# Altium project PCB_Project.PrjPcb
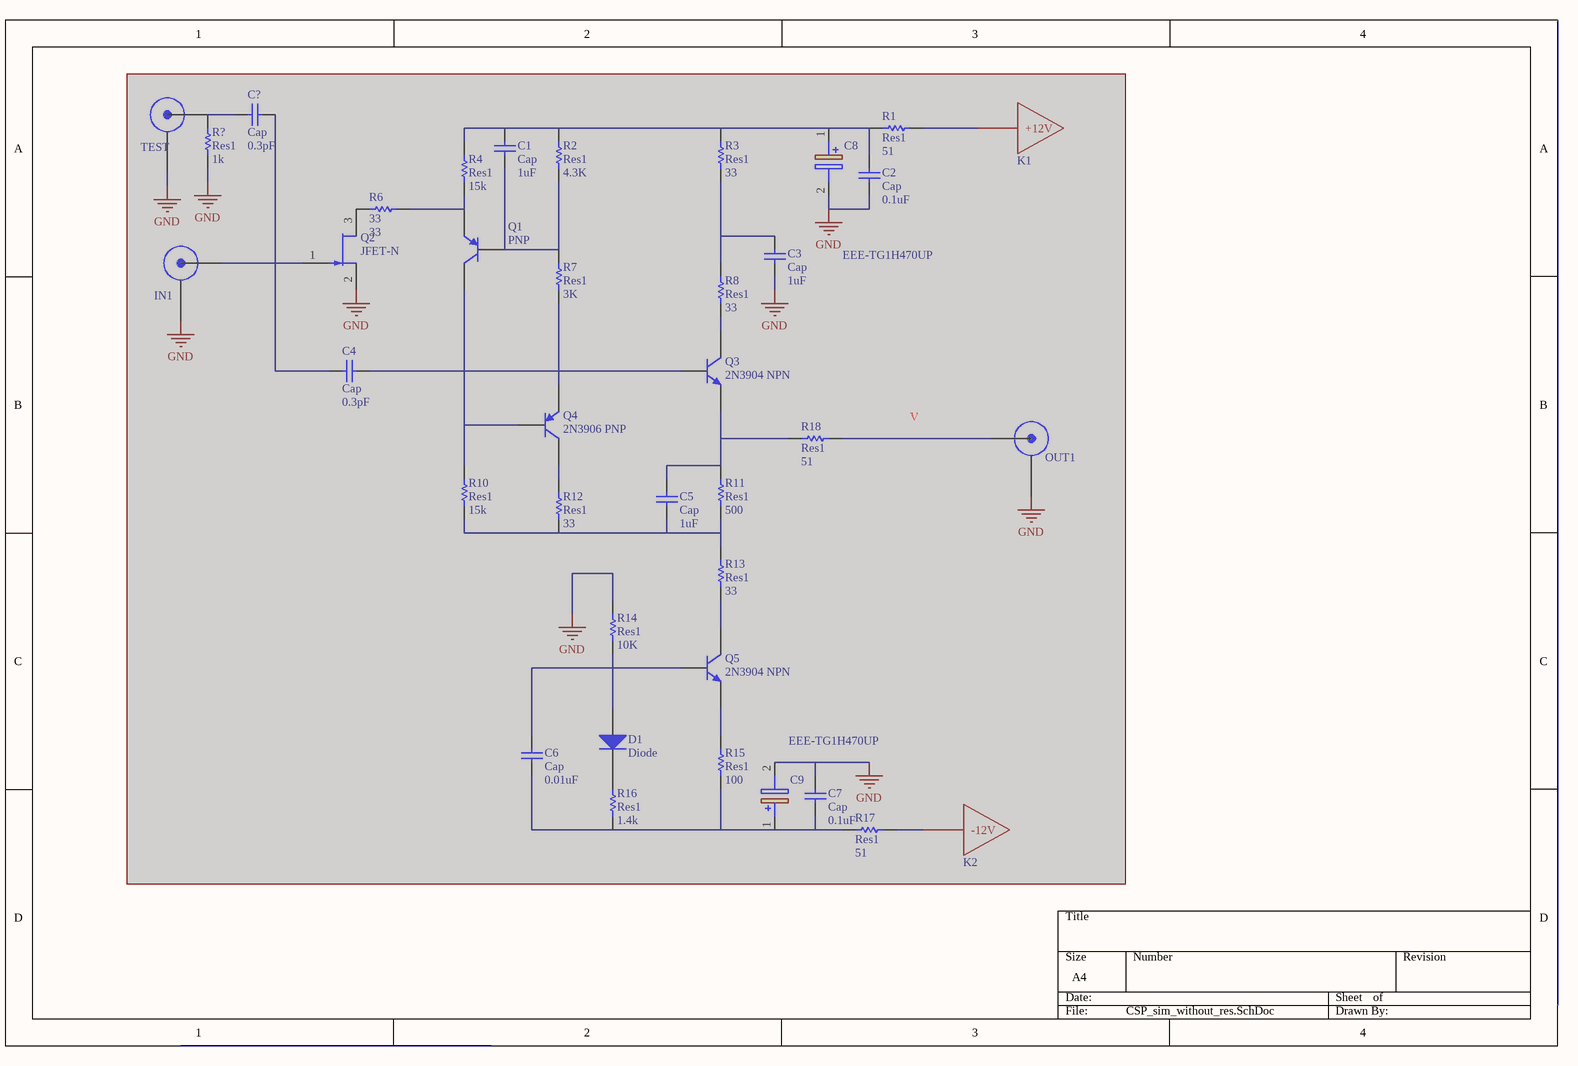
[diagram p0: CSP_sim_without_res.SchDoc]
4 sheets, 139 parts. Net scope: global (net labels, ports and power ports of the same name join across sheets).
Board files: CSP_without_inFET.PcbDoc, CSP_inFET.PcbDoc, Detector_PCB.PcbDoc, Panel.PcbDoc, Panel - Copy.PcbDoc
Sheets:
  CSP_sim_without_res.SchDoc
  CSP_sim_with_res.SchDoc
  CSP_without_inFET.SchDoc
  CSP_inFET.SchDoc

## Sheet CSP_sim_without_res.SchDoc
size A4; DocumentNumber: 1; SheetNumber: 1; SheetTotal: 4

### Parts
(Parts that share a designator on the sheet are numbered #1, #2 ... from top to bottom, then left to right.)
C1#1  Cap  value 1uF  [*CAPC2012X94N]  (masked out: inside a compile mask, not in the netlist)
C2#1  Cap  value 0.1uF  [*CAPC2012X94N]  (masked out: inside a compile mask, not in the netlist)
C3#1  Cap  value 1uF  [*CAPC2012X94N]  (masked out: inside a compile mask, not in the netlist)
C4#1  Cap  value 0.3pF  [0603]  (masked out: inside a compile mask, not in the netlist)
C5#1  Cap  value 1uF  [*CAPC2012X94N]  (masked out: inside a compile mask, not in the netlist)
C6#1  Cap  value 0.01uF  [*CAPC2012X94N]  (masked out: inside a compile mask, not in the netlist)
C7#1  Cap  value 0.1uF  [*CAPC2012X94N]  (masked out: inside a compile mask, not in the netlist)
C8#1  EEE-TG1H470UP  [CAPAE830X1050N]  (masked out: inside a compile mask, not in the netlist)
C9#1  EEE-TG1H470UP  [CAPAE830X1050N]  (masked out: inside a compile mask, not in the netlist)
C?  Cap  value 0.3pF  [0603]  (masked out: inside a compile mask, not in the netlist)
D1#1  Diode  [SODFL350X110-2N]  (masked out: inside a compile mask, not in the netlist)
IN1  INPUT  [IN/OUT]  (value not drawn)  (masked out: inside a compile mask, not in the netlist)
K1#1  +12V  [PAD]  (value not drawn)  (masked out: inside a compile mask, not in the netlist)
K2#1  -12V  [PAD]  (value not drawn)  (masked out: inside a compile mask, not in the netlist)
OUT1#1  OUTPUT  [IN/OUT]  (value not drawn)  (masked out: inside a compile mask, not in the netlist)
Q1#1  PNP  [SOT-23B_N]  (masked out: inside a compile mask, not in the netlist)
Q2#1  JFET-N  [SOT23_M]  (masked out: inside a compile mask, not in the netlist)
Q3#1  2N3904 NPN  [SOT23_M]  (masked out: inside a compile mask, not in the netlist)
Q4#1  2N3906 PNP  [SOT-23B_N]  (masked out: inside a compile mask, not in the netlist)
Q5#1  2N3904 NPN  [SOT23_M]  (masked out: inside a compile mask, not in the netlist)
R1#1  Res1  value 51  [SMD-0805-RES]  (masked out: inside a compile mask, not in the netlist)
R2#1  Res1  value 4.3K  [SMD-0805-RES]  (masked out: inside a compile mask, not in the netlist)
R3#1  Res1  value 33  [SMD-0805-RES]  (masked out: inside a compile mask, not in the netlist)
R4#1  Res1  value 15k  [SMD-0805-RES]  (masked out: inside a compile mask, not in the netlist)
R6#1  33  [SMD-0805-RES]  (masked out: inside a compile mask, not in the netlist)
R7#1  Res1  value 3K  [SMD-0805-RES]  (masked out: inside a compile mask, not in the netlist)
R8#1  Res1  value 33  [SMD-0805-RES]  (masked out: inside a compile mask, not in the netlist)
R10#1  Res1  value 15k  [SMD-0805-RES]  (masked out: inside a compile mask, not in the netlist)
R11#1  Res1  value 500  [SMD-0805-RES]  (masked out: inside a compile mask, not in the netlist)
R12#1  Res1  value 33  [SMD-0805-RES]  (masked out: inside a compile mask, not in the netlist)
R13#1  Res1  value 33  [SMD-0805-RES]  (masked out: inside a compile mask, not in the netlist)
R14#1  Res1  value 10K  [SMD-0805-RES]  (masked out: inside a compile mask, not in the netlist)
R15#1  Res1  value 100  [SMD-0805-RES]  (masked out: inside a compile mask, not in the netlist)
R16#1  Res1  value 1.4k  [SMD-0805-RES]  (masked out: inside a compile mask, not in the netlist)
R17#1  Res1  value 51  [SMD-0805-RES]  (masked out: inside a compile mask, not in the netlist)
R18#1  Res1  value 51  [SMD-0805-RES]  (masked out: inside a compile mask, not in the netlist)
R?  Res1  value 1k  [SMD-0805-RES]  (masked out: inside a compile mask, not in the netlist)
TEST#1  INPUT  [IN/OUT]  (value not drawn)  (masked out: inside a compile mask, not in the netlist)

### Library data of the parts
C1#1 C2#1 C3#1 C4#1 C5#1 C6#1 C7#1 C? = Cap: Capacitor; Published: 8-Jun-2000; LatestRevisionDate: 17-Jul-2002; LatestRevisionNote: Re-released for DXP Platform.; PackageReference: RAD-0.3; Publisher: Altium Limited; PackageDescription: Radial Cap, Thru-Hole; 2 Leads; 0.3 in Pin Spacing
C8#1 C9#1 = EEE-TG1H470UP: Capacitor Polarised; Manufacturer_Name: Panasonic; Datasheet Link: https://industrial.panasonic.com/cdbs/www-data/pdf/RDE0000/ABA0000C1187.pdf; Height: 10.5mm; Manufacturer_Part_Number: EEE-TG1H470UP
Q1#1 Q4#1 = PNP: PNP Bipolar Transistor; Published: 8-Jun-2000; LatestRevisionDate: 29-May-2009; LatestRevisionNote: IPC-7351 Footprint Added.; PackageVersion: Aug-1999; PackageReference: SOT-23B; Publisher: Altium Limited; PackageDescription: 3-Pin SOT-23 Package 0.95 mm Pitch, 2.4 mm Lead Span
Q2#1 = JFET-N: N-Channel JFET; Published: 8-Jun-2000; LatestRevisionDate: 17-Jul-2002; LatestRevisionNote: Re-released for DXP Platform.; PackageReference: TO-254-AA; Publisher: Altium Limited; Code_JEDEC: TO-254-AA
Q3#1 Q5#1 = NPN: NPN Bipolar Transistor; Published: 8-Jun-2000; LatestRevisionDate: 17-Jul-2002; LatestRevisionNote: Re-released for DXP Platform.; PackageReference: TO-226-AA; Publisher: Altium Limited; PackageDescription: TO, Flat Index; 3 In-Line, Axial Leads; Body Dia. 4.8mm; Leads 0.55 x 0.51 mm (max); Code_JEDEC: TO-226-AA
R1#1 R2#1 R3#1 R4#1 R6#1 R7#1 R8#1 R10#1 R11#1 R12#1 R13#1 R14#1 R15#1 R16#1 R17#1 R18#1 R? = Res1: Resistor; Published: 8-Jun-2000; LatestRevisionDate: 17-Jul-2002; LatestRevisionNote: Re-released for DXP Platform.; PackageReference: AXIAL-0.3; Publisher: Altium Limited; PackageDescription: Axial Device, Thru-Hole; 2 Leads; 0.3 in Pin Spacing
  R6#1: Value: 33

## Sheet CSP_sim_with_res.SchDoc
size A4; DocumentNumber: 4; SheetNumber: 4; SheetTotal: 4
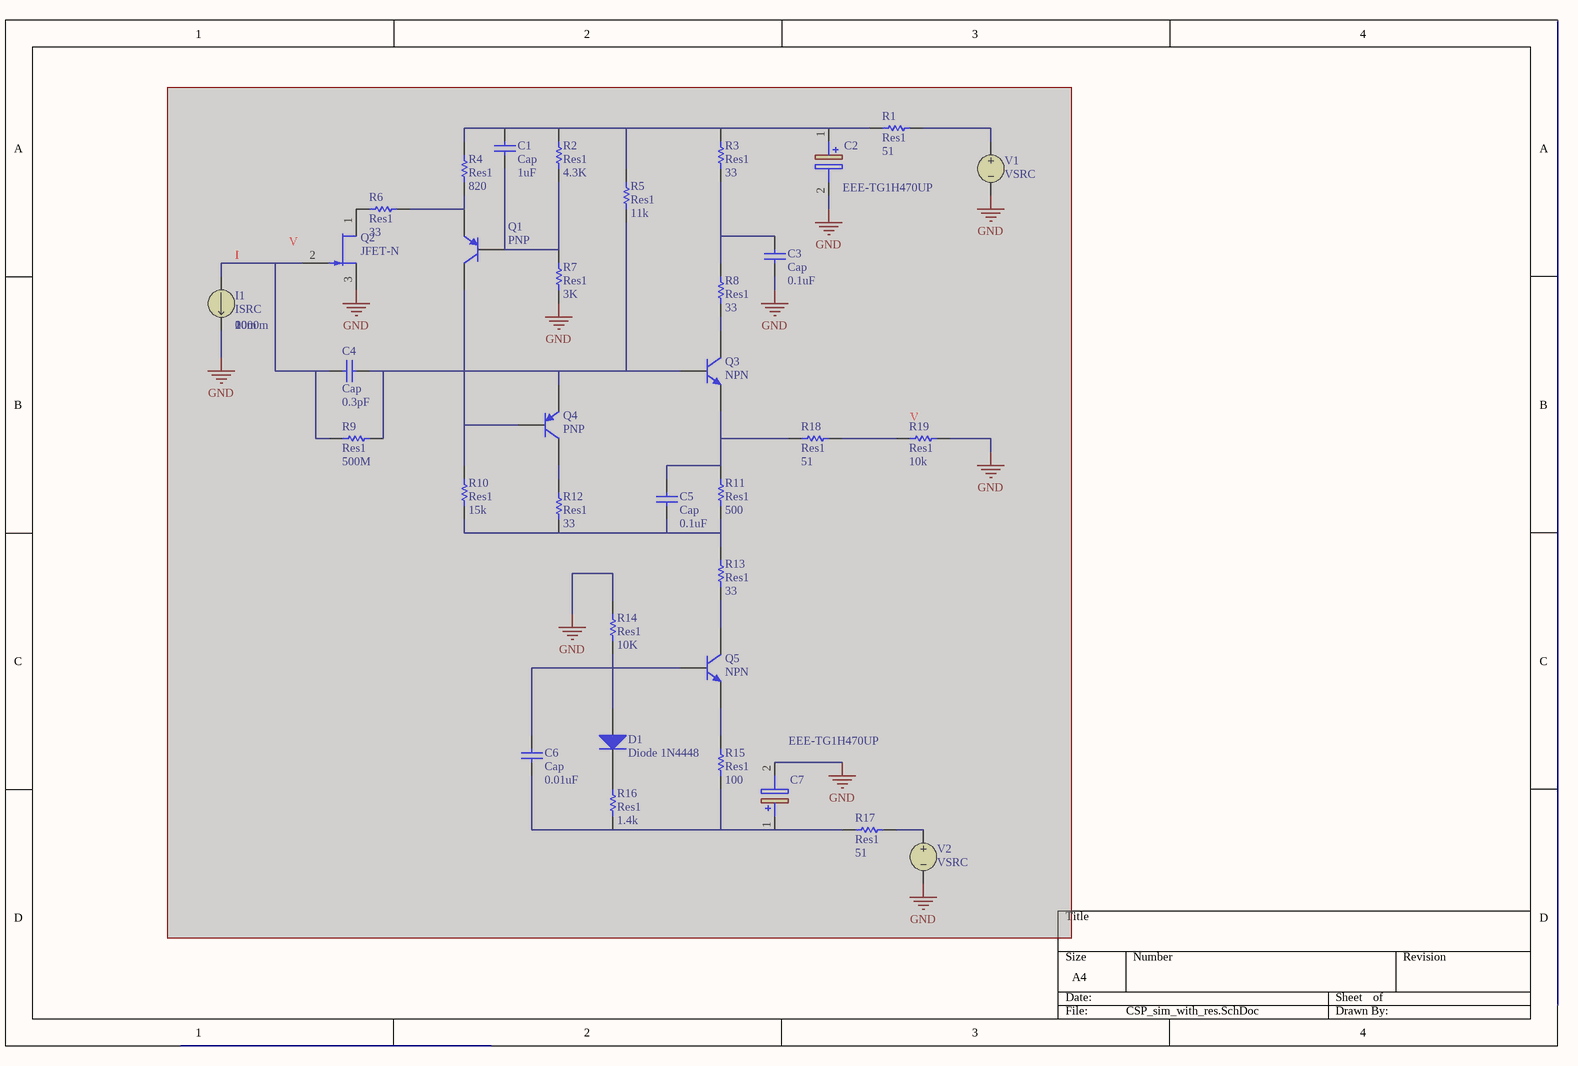
[diagram p1: CSP_sim_with_res.SchDoc]

### Parts
(Parts that share a designator on the sheet are numbered #1, #2 ... from top to bottom, then left to right.)
C1#2  Cap  value 1uF  [*CAPC2012X94N]  (masked out: inside a compile mask, not in the netlist)
C2#2  EEE-TG1H470UP  [CAPAE830X1050N]  (masked out: inside a compile mask, not in the netlist)
C3#2  Cap  value 0.1uF  [*CAPC2012X94N]  (masked out: inside a compile mask, not in the netlist)
C4#2  Cap  value 0.3pF  [0603]  (masked out: inside a compile mask, not in the netlist)
C5#2  Cap  value 0.1uF  [*CAPC2012X94N]  (masked out: inside a compile mask, not in the netlist)
C6#2  Cap  value 0.01uF  [*CAPC2012X94N]  (masked out: inside a compile mask, not in the netlist)
C7#2  EEE-TG1H470UP  [CAPAE830X1050N]  (masked out: inside a compile mask, not in the netlist)
D1#2  Diode 1N4448  [DO-35]  (masked out: inside a compile mask, not in the netlist)
I1  ISRC  Initial Value: 0  Pulsed Value: 1000m  Pulse Width: 10m  Period: 20m  (masked out: inside a compile mask, not in the netlist)
Q1#2  PNP  [SOT-23B_N]  (masked out: inside a compile mask, not in the netlist)
Q2#2  JFET-N  [TO-254-AA]  (masked out: inside a compile mask, not in the netlist)
Q3#2  NPN  [TO-226-AA]  (masked out: inside a compile mask, not in the netlist)
Q4#2  PNP  [SOT-23B_N]  (masked out: inside a compile mask, not in the netlist)
Q5#2  NPN  [TO-226-AA]  (masked out: inside a compile mask, not in the netlist)
R1#2  Res1  value 51  [SMD-0805-RES]  (masked out: inside a compile mask, not in the netlist)
R2#2  Res1  value 4.3K  [SMD-0805-RES]  (masked out: inside a compile mask, not in the netlist)
R3#2  Res1  value 33  [SMD-0805-RES]  (masked out: inside a compile mask, not in the netlist)
R4#2  Res1  value 820  [SMD-0805-RES]  (masked out: inside a compile mask, not in the netlist)
R5#1  Res1  value 11k  [SMD-0805-RES]  (masked out: inside a compile mask, not in the netlist)
R6#2  Res1  value 33  [SMD-0805-RES]  (masked out: inside a compile mask, not in the netlist)
R7#2  Res1  value 3K  [SMD-0805-RES]  (masked out: inside a compile mask, not in the netlist)
R8#2  Res1  value 33  [SMD-0805-RES]  (masked out: inside a compile mask, not in the netlist)
R9#1  Res1  value 500M  [SMD-0805-RES]  (masked out: inside a compile mask, not in the netlist)
R10#2  Res1  value 15k  [SMD-0805-RES]  (masked out: inside a compile mask, not in the netlist)
R11#2  Res1  value 500  [SMD-0805-RES]  (masked out: inside a compile mask, not in the netlist)
R12#2  Res1  value 33  [SMD-0805-RES]  (masked out: inside a compile mask, not in the netlist)
R13#2  Res1  value 33  [SMD-0805-RES]  (masked out: inside a compile mask, not in the netlist)
R14#2  Res1  value 10K  [SMD-0805-RES]  (masked out: inside a compile mask, not in the netlist)
R15#2  Res1  value 100  [SMD-0805-RES]  (masked out: inside a compile mask, not in the netlist)
R16#2  Res1  value 1.4k  [SMD-0805-RES]  (masked out: inside a compile mask, not in the netlist)
R17#2  Res1  value 51  [SMD-0805-RES]  (masked out: inside a compile mask, not in the netlist)
R18#2  Res1  value 51  [SMD-0805-RES]  (masked out: inside a compile mask, not in the netlist)
R19  Res1  value 10k  [SMD-0805-RES]  (masked out: inside a compile mask, not in the netlist)
V1  VSRC  (masked out: inside a compile mask, not in the netlist)
V2  VSRC  (masked out: inside a compile mask, not in the netlist)

### Library data of the parts
C1#2 C3#2 C4#2 C5#2 C6#2 = Cap: Capacitor; Published: 8-Jun-2000; LatestRevisionDate: 17-Jul-2002; LatestRevisionNote: Re-released for DXP Platform.; PackageReference: RAD-0.3; Publisher: Altium Limited; PackageDescription: Radial Cap, Thru-Hole; 2 Leads; 0.3 in Pin Spacing
C2#2 C7#2 = EEE-TG1H470UP: as C8#1 on sheet CSP_sim_without_res; Datasheet Link: https://industrial.panasonic.com/cdbs/www-data/pdf/RDE0000/ABA0000C1187.pdf; Height: 10.5mm; Manufacturer_Part_Number: EEE-TG1H470UP
D1#2 = Diode 1N4448: High Conductance Fast Diode; Published: 8-Jun-2000; LatestRevisionDate: 17-Jul-2002; LatestRevisionNote: Re-released for DXP Platform.; DatasheetVersion: 1997; PackageReference: DO-35; Publisher: Altium Limited; PackageDescription: Diode, Axial; Body 3.8 x 1.9 mm (LxDia. max), Lead Dia. 0.53 mm (max); Code_JEDEC: DO-204-AH; ComponentLink1Description: Manufacturer Link; ComponentLink1URL: http://www.fairchildsemi.com/; ComponentLink2Description: Datasheet; ComponentLink2URL: http://www.fairchildsemi.com/ds/1N%2F1N4448.pdf
I1 = ISRC: Current Source; Note: PCB Footprint - Not required; Published: 8-Jun-2000; LatestRevisionDate: 17-Jul-2002; LatestRevisionNote: Re-released for DXP Platform.; PackageReference: Not Applicable; Publisher: Altium Limited
Q1#2 Q4#2 = PNP: PNP Bipolar Transistor; Published: 8-Jun-2000; LatestRevisionDate: 29-May-2009; LatestRevisionNote: IPC-7351 Footprint Added.; PackageVersion: Aug-1999; PackageReference: SOT-23B; Publisher: Altium Limited; PackageDescription: 3-Pin SOT-23 Package 0.95 mm Pitch, 2.4 mm Lead Span
Q2#2 = JFET-N: N-Channel JFET; Published: 8-Jun-2000; LatestRevisionDate: 17-Jul-2002; LatestRevisionNote: Re-released for DXP Platform.; PackageReference: TO-254-AA; Publisher: Altium Limited; Code_JEDEC: TO-254-AA
Q3#2 Q5#2 = NPN: NPN Bipolar Transistor; Published: 8-Jun-2000; LatestRevisionDate: 17-Jul-2002; LatestRevisionNote: Re-released for DXP Platform.; PackageReference: TO-226-AA; Publisher: Altium Limited; PackageDescription: TO, Flat Index; 3 In-Line, Axial Leads; Body Dia. 4.8mm; Leads 0.55 x 0.51 mm (max); Code_JEDEC: TO-226-AA
R1#2 R2#2 R3#2 R4#2 R5#1 R6#2 R7#2 R8#2 R9#1 R10#2 R11#2 R12#2 R13#2 R14#2 R15#2 R16#2 R17#2 R18#2 R19 = Res1: Resistor; Published: 8-Jun-2000; LatestRevisionDate: 17-Jul-2002; LatestRevisionNote: Re-released for DXP Platform.; PackageReference: AXIAL-0.3; Publisher: Altium Limited; PackageDescription: Axial Device, Thru-Hole; 2 Leads; 0.3 in Pin Spacing
V1 = VSRC: Voltage Source; Note: PCB Footprint - Not required; Value: 12; Published: 8-Jun-2000; LatestRevisionDate: 17-Jul-2002; LatestRevisionNote: Re-released for DXP Platform.; PackageReference: Not Applicable; Publisher: Altium Limited
V2 = VSRC: Voltage Source; Note: PCB Footprint - Not required; Value: -12; Published: 8-Jun-2000; LatestRevisionDate: 17-Jul-2002; LatestRevisionNote: Re-released for DXP Platform.; PackageReference: Not Applicable; Publisher: Altium Limited

## Sheet CSP_without_inFET.SchDoc
size A4; DocumentNumber: 2; SheetNumber: 2; SheetTotal: 4
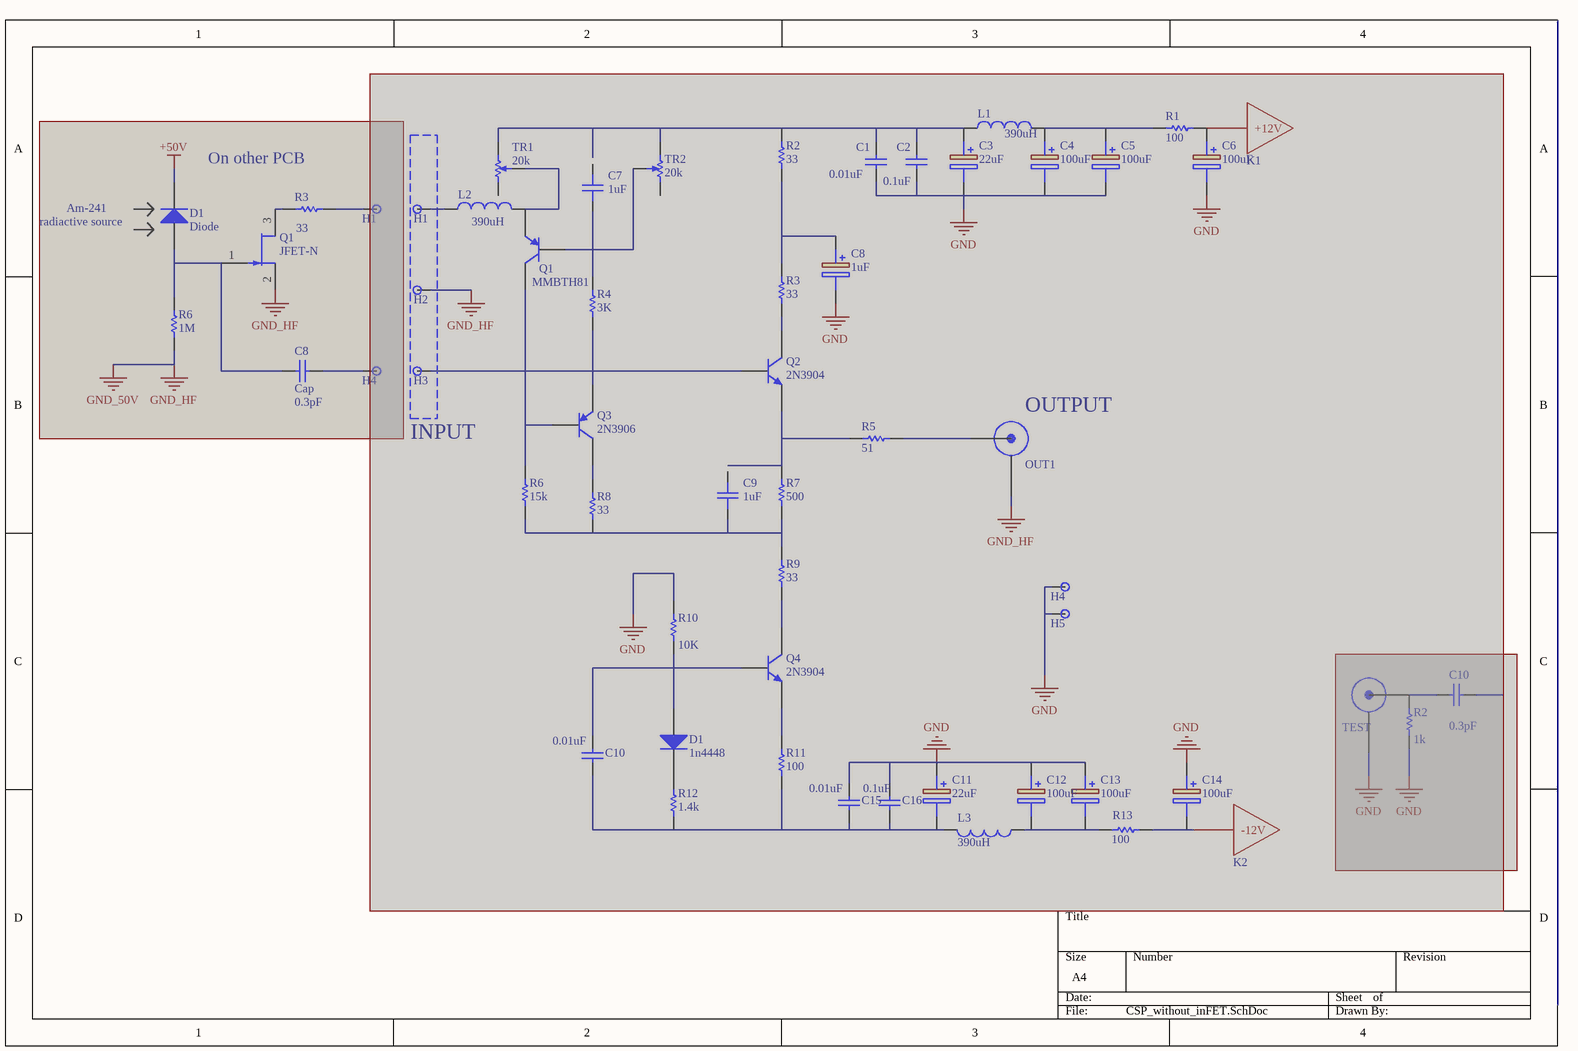
[diagram p2: CSP_without_inFET.SchDoc]

### Parts
(Parts that share a designator on the sheet are numbered #1, #2 ... from top to bottom, then left to right.)
C1#3  0.01uF  [SMD-0805-C]  (masked out: inside a compile mask, not in the netlist)
C2#3  0.1uF  [SMD-0805-C]  (masked out: inside a compile mask, not in the netlist)
C3#3  22uF  [CAPAE660X550N]  (masked out: inside a compile mask, not in the netlist)
C4#3  100uF  [CAPAE660X800N]  (masked out: inside a compile mask, not in the netlist)
C5#3  100uF  [CAPAE660X800N]  (masked out: inside a compile mask, not in the netlist)
C6#3  100uF  [CAPAE660X800N]  (masked out: inside a compile mask, not in the netlist)
C7#3  1uF  [CAPC3225X15L]  (masked out: inside a compile mask, not in the netlist)
C8#2  1uF  [CAPAE430X550N]  (masked out: inside a compile mask, not in the netlist)
C8#3  Cap  value 0.3pF  [0603]  (masked out: inside a compile mask, not in the netlist)
C9#2  1uF  [CAPC3225X15L]  (masked out: inside a compile mask, not in the netlist)
C10#1  value 0.3pF  [0603]  (hidden comment: Cap)  (masked out: inside a compile mask, not in the netlist)
C10#2  0.01uF  [SMD-0805-C]  (masked out: inside a compile mask, not in the netlist)
C11  22uF  [CAPAE660X550N]  (masked out: inside a compile mask, not in the netlist)
C12  100uF  [CAPAE660X800N]  (masked out: inside a compile mask, not in the netlist)
C13  100uF  [CAPAE660X800N]  (masked out: inside a compile mask, not in the netlist)
C14  100uF  [CAPAE660X800N]  (masked out: inside a compile mask, not in the netlist)
C15  0.01uF  [SMD-0805-C]  (masked out: inside a compile mask, not in the netlist)
C16  0.1uF  [SMD-0805-C]  (masked out: inside a compile mask, not in the netlist)
D1#3  Diode  [SMC]  (masked out: inside a compile mask, not in the netlist)
D1#4  1n4448  [SODFL350X110-2N]  (masked out: inside a compile mask, not in the netlist)
H1#1  PAD  [PAD]  (value not drawn)  (no BOM)  (masked out: inside a compile mask, not in the netlist)
H1#2  PAD  [PAD]  (value not drawn)  (no BOM)  (masked out: inside a compile mask, not in the netlist)
H2  PAD  [PAD]  (value not drawn)  (no BOM)  (masked out: inside a compile mask, not in the netlist)
H3  PAD  [PAD]  (value not drawn)  (no BOM)  (masked out: inside a compile mask, not in the netlist)
H4#1  PAD  [PAD]  (value not drawn)  (no BOM)  (masked out: inside a compile mask, not in the netlist)
H4#2  PAD  [PAD]  (value not drawn)  (no BOM)  (masked out: inside a compile mask, not in the netlist)
H5  PAD  [PAD]  (value not drawn)  (no BOM)  (masked out: inside a compile mask, not in the netlist)
K1#2  +12V  [PAD]  (value not drawn)  (no BOM)  (masked out: inside a compile mask, not in the netlist)
K2#2  -12V  [PAD]  (value not drawn)  (no BOM)  (masked out: inside a compile mask, not in the netlist)
L1  390uH  [INDC3225X270N]  (masked out: inside a compile mask, not in the netlist)
L2  390uH  [INDC3225X270N]  (masked out: inside a compile mask, not in the netlist)
L3  390uH  [INDC3225X270N]  (masked out: inside a compile mask, not in the netlist)
OUT1#2  OUTPUT  [IN/OUT]  (value not drawn)  (no BOM)  (masked out: inside a compile mask, not in the netlist)
Q1#3  JFET-N  [SOT23_M]  (masked out: inside a compile mask, not in the netlist)
Q1#4  MMBTH81  [SOT23-3P95_240X110L53X44N]  (masked out: inside a compile mask, not in the netlist)
Q2#3  2N3904  [SOT23-3P95_240X110L53X44N]  (masked out: inside a compile mask, not in the netlist)
Q3#3  2N3906  [SOT23-3P95_240X110L53X44N]  (masked out: inside a compile mask, not in the netlist)
Q4#3  2N3904  [SOT23-3P95_240X110L53X44N]  (masked out: inside a compile mask, not in the netlist)
R1#3  100  [SMD-0805-RES]  (masked out: inside a compile mask, not in the netlist)
R2#3  33  [SMD-0805-RES]  (masked out: inside a compile mask, not in the netlist)
R2#4  value 1k  [SMD-0805-RES]  (hidden comment: Res1)  (masked out: inside a compile mask, not in the netlist)
R3#3  value 33  [SMD-0805-RES]  (masked out: inside a compile mask, not in the netlist)
R3#4  33  [SMD-0805-RES]  (masked out: inside a compile mask, not in the netlist)
R4#3  3K  [SMD-0805-RES]  (masked out: inside a compile mask, not in the netlist)
R5#2  51  [SMD-0805-RES]  (masked out: inside a compile mask, not in the netlist)
R6#3  value 1M  [SMD-0805-RES]  (masked out: inside a compile mask, not in the netlist)
R6#4  15k  [SMD-0805-RES]  (masked out: inside a compile mask, not in the netlist)
R7#3  500  [SMD-0805-RES]  (masked out: inside a compile mask, not in the netlist)
R8#3  33  [SMD-0805-RES]  (masked out: inside a compile mask, not in the netlist)
R9#2  33  [SMD-0805-RES]  (masked out: inside a compile mask, not in the netlist)
R10#3  10K  [SMD-0805-RES]  (masked out: inside a compile mask, not in the netlist)
R11#3  100  [SMD-0805-RES]  (masked out: inside a compile mask, not in the netlist)
R12#3  1.4k  [SMD-0805-RES]  (masked out: inside a compile mask, not in the netlist)
R13#3  100  [SMD-0805-RES]  (masked out: inside a compile mask, not in the netlist)
TEST#2  INPUT  [IN/OUT]  (value not drawn)  (masked out: inside a compile mask, not in the netlist)
TR1  20k  [POT4MM-2]  (masked out: inside a compile mask, not in the netlist)
TR2  20k  [POT4MM-2]  (masked out: inside a compile mask, not in the netlist)

### Blocks framed on the sheet
On other PCB: C8#3 D1#3 H1#1 H4#1 Q1#3 R3#3 R6#3

### Notes on the sheet
- (near D1#3) radiactive source
- Am-241
- INPUT
- (near OUT1#2) OUTPUT

### Library data of the parts
C1#3 C2#3 C8#3 C10#1 C10#2 C15 C16 = Cap: Capacitor; Published: 8-Jun-2000; LatestRevisionDate: 17-Jul-2002; LatestRevisionNote: Re-released for DXP Platform.; PackageReference: RAD-0.3; Publisher: Altium Limited; PackageDescription: Radial Cap, Thru-Hole; 2 Leads; 0.3 in Pin Spacing
  C1#3 C10#2 C15: Value: 0.01uF; LCSC Part #: C1710
  C2#3 C16: Value: 0.1uF; LCSC Part #: C49678
C3#3 C11 = TYEH1V226F55MTR: 22uF 35V, Capacitor Polarised; Part number: TYEH1V226F55MTR; Value: 22uF; Dimension: 6.3x5.3mm; Voltage: 35V; LCSC Part #: C249771
C4#3 C5#3 C6#3 C12-C14 = EEEFK1E101P: 100uF 25V, cap polarised; Part number: EEEFK1E101P; Dimensions: 8x6.2mm; Voltage: 25V; Value: 100uF; LCSC Part #: C249983
C7#3 C9#2 = capacitor: Value: 1uF
C8#2 = UWT1H010MCL1GB: 1uF 50V, Capacitor Polarised; Manufacturer_Name: Nichicon; Part number: UWT1H010MCL1GB; Dimensions: 4x5.4mm; Value: 1uF; Voltage: 50V; LCSC Part #: *
D1#3 = Diode: Default Diode; Published: 8-Jun-2000; LatestRevisionDate: 17-Jul-2002; LatestRevisionNote: Re-released for DXP Platform.; PackageVersion: Sep-1996; PackageReference: SMC; Publisher: Altium Limited; PackageDescription: DO-214-AB/SMC; 2 C-Bend Leads; Body 7.9 x 5.9 mm, inc. leads (LxW); Code_JEDEC: DO-214-AB
D1#4 = Diode: SOD123, 1n4446 orginally; Value: 1n4448; LCSC Part #: C108428
L1-L3 = NLV10JT391: 390uH, Inductor, LCSC part is 330uH1!!!; Resistance: 36; Value: 390uH; Package: 1210; LCSC Part #: C87557
Q1#3 = JFET-N: N-Channel JFET; Published: 8-Jun-2000; LatestRevisionDate: 17-Jul-2002; LatestRevisionNote: Re-released for DXP Platform.; PackageReference: TO-254-AA; Publisher: Altium Limited; Code_JEDEC: TO-254-AA
Q1#4 = PNP: PNP Bipolar Transistor, Aternatives: NTE2403; Published: 8-Jun-2000; LatestRevisionDate: 29-May-2009; LatestRevisionNote: IPC-7351 Footprint Added.; PackageVersion: Aug-1999; PackageReference: SOT-23B; Publisher: Altium Limited; PackageDescription: 3-Pin SOT-23 Package 0.95 mm Pitch, 2.4 mm Lead Span; Supplier 1: Arrow; Supplier Part Number 1: MMBTH81; Supplier 2: Digi-Key; Supplier Part Number 2: KST10MTFCT-ND; Value: MMBTH81; LCSC Part #: C190349
Q2#3 Q4#3 = NPN: NPN Bipolar Transistor; Published: 8-Jun-2000; LatestRevisionDate: 17-Jul-2002; LatestRevisionNote: Re-released for DXP Platform.; PackageReference: TO-226-AA; Publisher: Altium Limited; PackageDescription: TO, Flat Index; 3 In-Line, Axial Leads; Body Dia. 4.8mm; Leads 0.55 x 0.51 mm (max); Code_JEDEC: TO-226-AA; Value: 2N3904; LCSC Part #: C18536
Q3#3 = PNP: PNP Bipolar Transistor; Published: 8-Jun-2000; LatestRevisionDate: 29-May-2009; LatestRevisionNote: IPC-7351 Footprint Added.; PackageVersion: Aug-1999; PackageReference: SOT-23B; Publisher: Altium Limited; PackageDescription: 3-Pin SOT-23 Package 0.95 mm Pitch, 2.4 mm Lead Span; Value: 2N3906; LCSC Part #: C14488
R1#3 R2#3 R2#4 R3#3 R3#4 R4#3 R5#2 R6#3 R6#4 R7#3 R8#3 R9#2 R10#3 R11#3 R12#3 R13#3 = Res1: Resistor; Published: 8-Jun-2000; LatestRevisionDate: 17-Jul-2002; LatestRevisionNote: Re-released for DXP Platform.; PackageReference: AXIAL-0.3; Publisher: Altium Limited; PackageDescription: Axial Device, Thru-Hole; 2 Leads; 0.3 in Pin Spacing
  R1#3 R11#3 R13#3: Value: 100; LCSC Part #: C17408
  R2#3 R3#4 R8#3 R9#2: Value: 33; LCSC Part #: C17634
  R4#3: Value: 3K; LCSC Part #: C17661
  R5#2: Value: 51; LCSC Part #: C17738
  R6#4: Value: 15k; LCSC Part #: C17475
  R7#3: Value: 500; LCSC Part #: C17734
  R10#3: Value: 10K; LCSC Part #: C17414
  R12#3: Value: 1.4k; LCSC Part #: C17388
TR1 TR2 = RPot SM: Square Trimming Potentiometer; Published: 17-Dec-2003; DatasheetVersion: Oct-2003; PackageReference: POT4MM-2; Publisher: Altium Limited; PackageDescription: Square Trimming Potentiometer; ComponentLink1Description: Manufacturer Link; ComponentLink1URL: http://bourns.com/2/search.html; Value: 20k; LCSC Part #: *

## Sheet CSP_inFET.SchDoc
size A4; DocumentNumber: 3; SheetNumber: 3; SheetTotal: 4
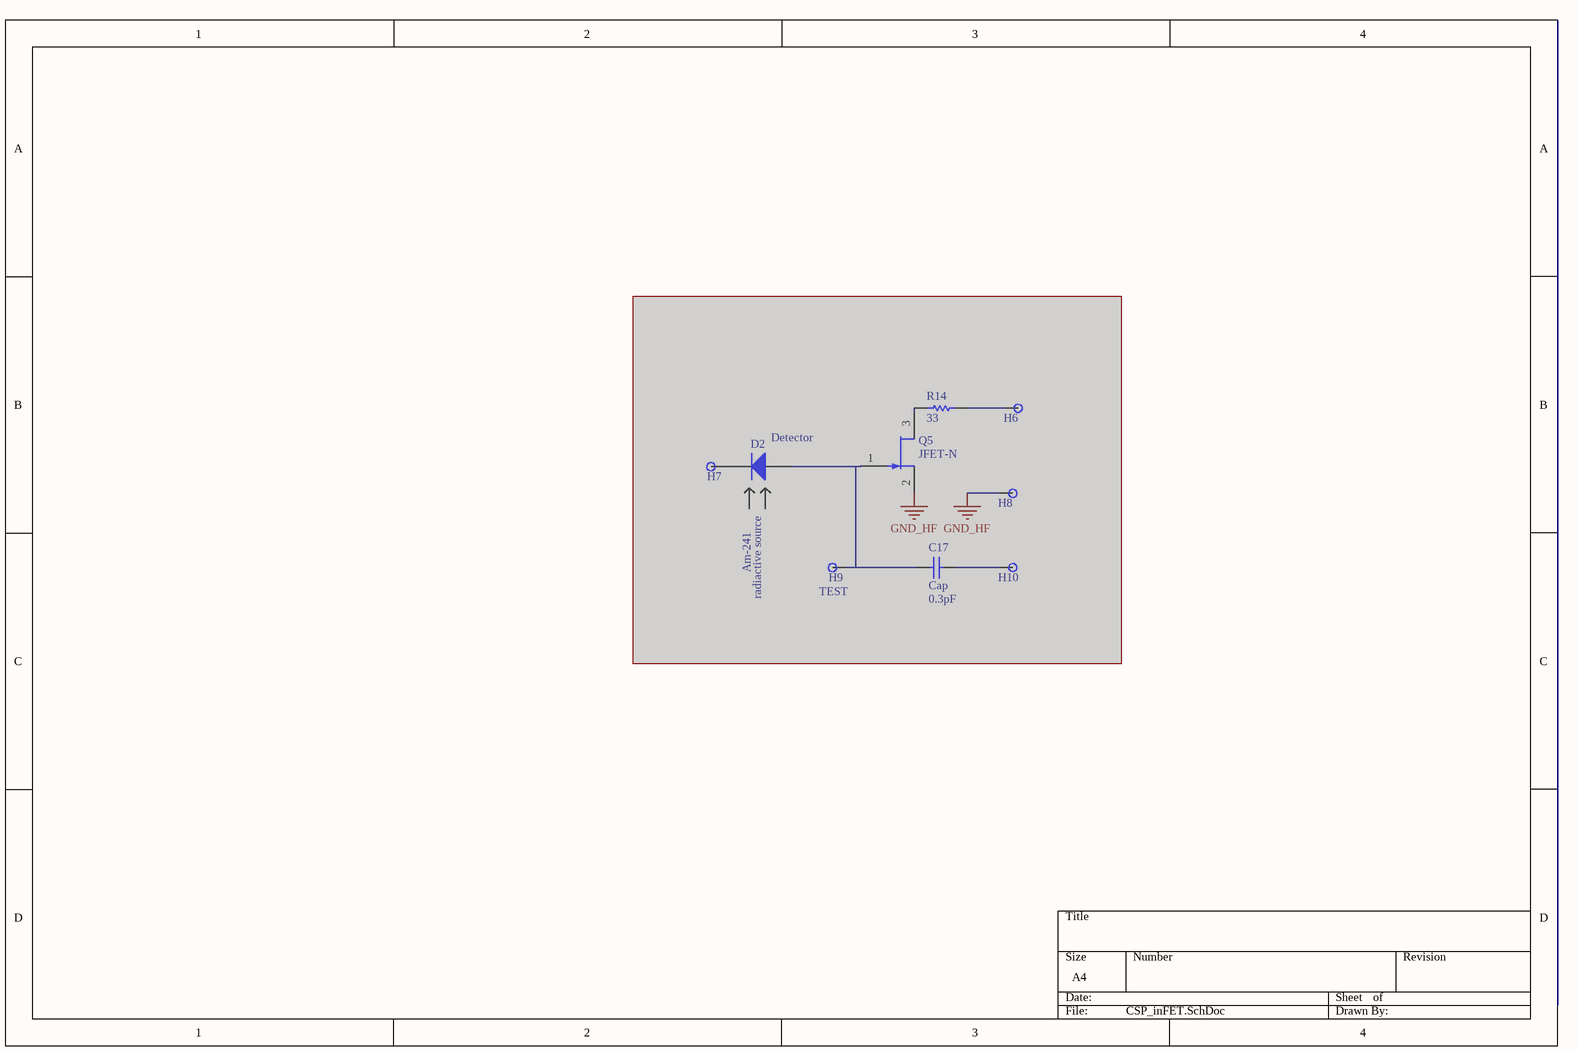
[diagram p3: CSP_inFET.SchDoc]

### Parts
(Parts that share a designator on the sheet are numbered #1, #2 ... from top to bottom, then left to right.)
C17  Cap  value 0.3pF  [CAPC160X80X90L35N]  (masked out: inside a compile mask, not in the netlist)
D2  Detector  [Detector]  (masked out: inside a compile mask, not in the netlist)
H6  PAD  [PAD_rounded]  (value not drawn)  (no BOM)  (masked out: inside a compile mask, not in the netlist)
H7  PAD  [PAD_rounded]  (value not drawn)  (no BOM)  (masked out: inside a compile mask, not in the netlist)
H8  PAD  [PAD_rounded]  (value not drawn)  (no BOM)  (masked out: inside a compile mask, not in the netlist)
H9  TEST  [PAD_rounded]  (no BOM)  (masked out: inside a compile mask, not in the netlist)
H10  PAD  [PAD_rounded]  (value not drawn)  (no BOM)  (masked out: inside a compile mask, not in the netlist)
Q5#3  JFET-N  [SOT23-3P95_240X114L20X40N]  (masked out: inside a compile mask, not in the netlist)
R14#3  33  [RESC200X125X70L40N]  (masked out: inside a compile mask, not in the netlist)

### Notes on the sheet
- Am-241
- radiactive source

### Library data of the parts
C17 = Cap: Capacitor; Published: 8-Jun-2000; LatestRevisionDate: 17-Jul-2002; LatestRevisionNote: Re-released for DXP Platform.; PackageReference: RAD-0.3; Publisher: Altium Limited; PackageDescription: Radial Cap, Thru-Hole; 2 Leads; 0.3 in Pin Spacing; LCSC Part #: *
D2 = Diode
H9 = PAD
Q5#3 = JFET-N: N-Channel JFET; Published: 8-Jun-2000; LatestRevisionDate: 17-Jul-2002; LatestRevisionNote: Re-released for DXP Platform.; PackageReference: TO-254-AA; Publisher: Altium Limited; Code_JEDEC: TO-254-AA; LCSC Part #: *
R14#3 = Res1: Resistor; Published: 8-Jun-2000; LatestRevisionDate: 17-Jul-2002; LatestRevisionNote: Re-released for DXP Platform.; PackageReference: AXIAL-0.3; Publisher: Altium Limited; PackageDescription: Axial Device, Thru-Hole; 2 Leads; 0.3 in Pin Spacing; Value: 33; LCSC Part #: *